# Altium schematic sheet SPILoRav5.SchDoc
size A
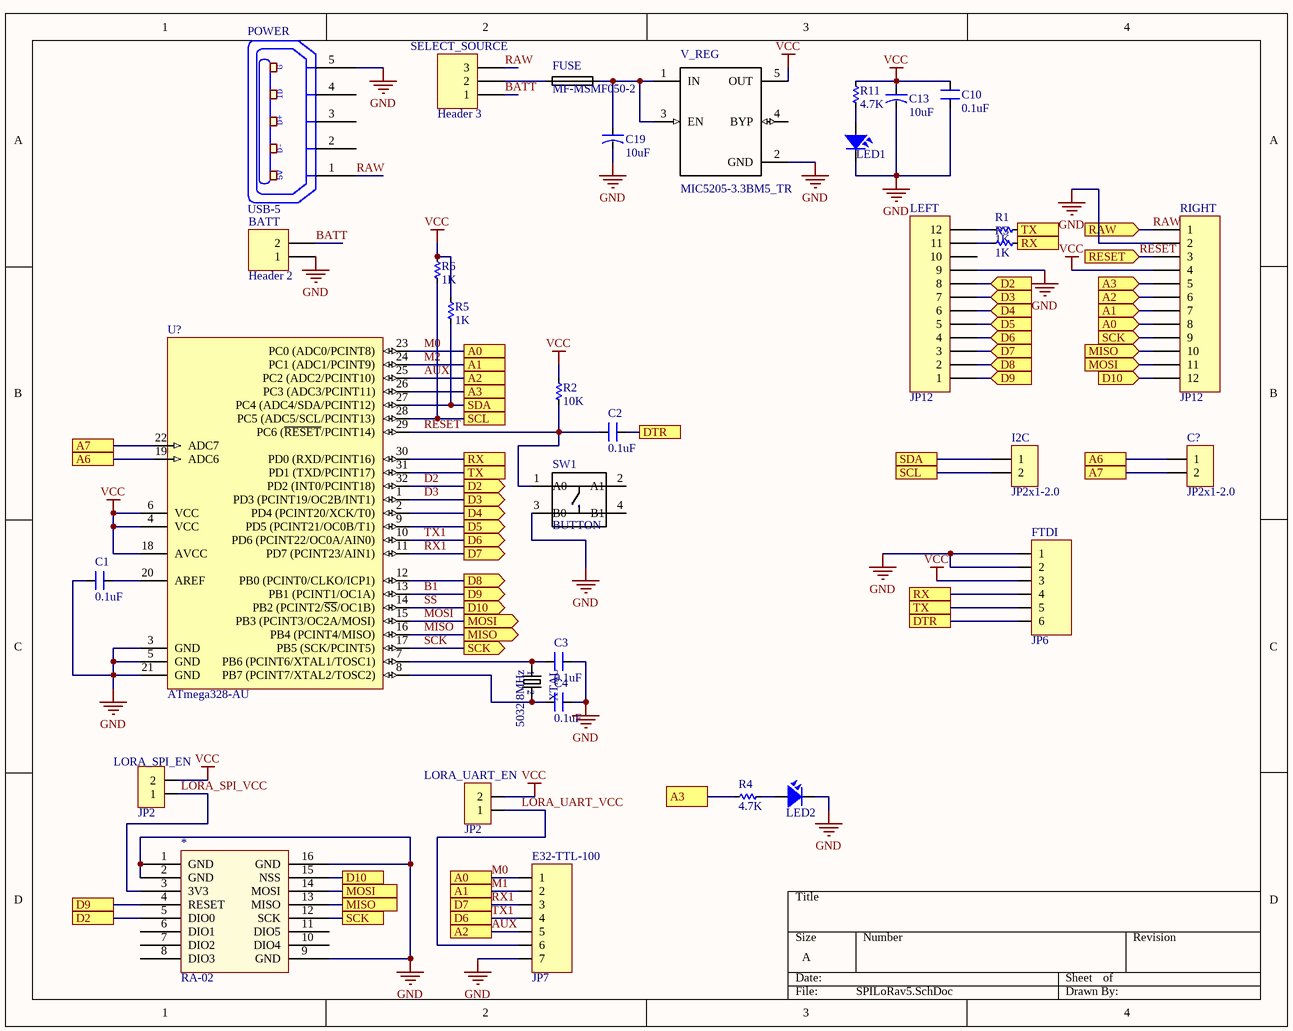
[diagram p0: SPILoRav5.SchDoc]

## Parts
*  RA-02  [RA-02]
BATT  Header 2  [HDR1X2]
C1  0.1uF  [CN-SMD-0805]
C2  0.1uF  [CN-SMD-0805]
C3  0.1uF  [CN-SMD-0805]
C4  0.1uF  [CN-SMD-0805]
C10  0.1uF  [CN-SMD-0805]
C13  10uF  [CAP-ALU-SMD-4.5x5x1.4]
C19  10uF  [CAP-ALU-SMD-4.5x5x1.4]
C?  JP2x1-2.0  [J2-C1T]
E32-TTL-100  JP7  [JP7-D1T]
FTDI  JP6  [JP6-C1T]
FUSE  MF-MSMF050-2  [*FUSM1812X02]
I2C  JP2x1-2.0  [J2-C1T]
LED1  LED  [LED-0805-Red]  (value not drawn)
LED2  LED  [LED-0805-Red]  (value not drawn)
LEFT  JP12  [JP12-D1T]
LORA_SPI_EN  JP2  [JP2-D1T]
LORA_UART_EN  JP2  [JP2-D1T]
POWER  USB-5  [USB-M1]
R1  1K  [RES-SMD-0805]
R2  10K  [RES-SMD-0805]
R3  1K  [RES-SMD-0805]
R4  4.7K  [RES-SMD-0805]
R5  1K  [RES-SMD-0805]
R6  1K  [RES-SMD-0805]
R11  4.7K  [RES-SMD-0805]
RIGHT  JP12  [JP12-D1T]
SELECT_SOURCE  Header 3  [HDR1X3]
SW1  BUTTON  [*SW4-SMD-5.2X5.2X1.5MM]
U?  ATmega328-AU  [TQFP32]
V_REG  MIC5205-3.3BM5_TR  [*SOT95P280X145-5N]
XTAL  5032 8MHz  [*X2-SMD-5.0X3.2X1.3MM]

## Ports
A0, A0 (in), A1, A1 (in), A2, A2 (in), A3, A3 (in), A6, A7, D2, D2 (in), D2 (out), D3 (in), D3 (out), D4 (in), D4 (out), D5 (in), D5 (out), D6, D6 (in), D6 (out), D7, D7 (in), D7 (out), D8 (in), D8 (out), D9, D9 (in), D9 (out), D10, D10 (in), D10 (out), DTR, MISO, MISO (in), MISO (out), MOSI, MOSI (in), MOSI (out), RAW (in), RESET (in), RX, RX (in), SCK, SCK (in), SCK (out), SCL, SDA, TX, TX (in)

## Nets
GND: *.1(GND) *.2(GND) *.9(GND) *.16(GND) BATT.1 C1.2 C3.1 C4.1 C10.1 C13.2 C19.2 E32-TTL-100.7 FTDI.1 FTDI.2 LED1.2 LED2.2 LEFT.9 POWER.5(P5) RIGHT.2 SW1.3(B0) U?.3(GND) U?.5(GND) U?.21(GND) V_REG.2(GND)
VCC: C10.2 C13.1 FTDI.3 LORA_SPI_EN.2 LORA_UART_EN.2 R2.1 R5.1 R6.1 R11.1 RIGHT.4 U?.4(VCC) U?.6(VCC) U?.18(AVCC) V_REG.5(OUT)
A3: R4.1 RIGHT.5 U?.26(PC3_(ADC3/PCINT11)) ; port A3
A6: C?.1 U?.19(ADC6) ; port A6
A7: C?.2 U?.22(ADC7) ; port A7
AUX: E32-TTL-100.5 RIGHT.6 U?.25(PC2_(ADC2/PCINT10)) ; port A2
B1: *.4(RESET) LEFT.1 U?.13(PB1_(PCINT1/OC1A)) ; port D9
BATT: BATT.2 SELECT_SOURCE.1
D2: *.5(DIO0) LEFT.8 U?.32(PD2_(INT0/PCINT18)) ; port D2
D3: LEFT.7 U?.1(PD3_(PCINT19/OC2B/INT1)) ; port D3
D4: LEFT.6 U?.2(PD4_(PCINT20/XCK/T0)) ; port D4
D5: LEFT.5 U?.9(PD5_(PCINT21/OC0B/T1)) ; port D5
D8: LEFT.2 U?.12(PB0_(PCINT0/CLKO/ICP1)) ; port D8
DTR: C2.2 FTDI.6 ; port DTR
LORA_SPI_VCC: *.3(3V3) LORA_SPI_EN.1
LORA_UART_VCC: E32-TTL-100.6 LORA_UART_EN.1
M0: E32-TTL-100.1 RIGHT.8 U?.23(PC0_(ADC0/PCINT8)) ; port A0
M1: E32-TTL-100.2 RIGHT.7 U?.24(PC1_(ADC1/PCINT9)) ; port A1  [also labelled M2]
MISO: *.13(MISO) RIGHT.10 U?.16(PB4_(PCINT4/MISO)) ; port MISO
MOSI: *.14(MOSI) RIGHT.11 U?.15(PB3_(PCINT3/OC2A/MOSI)) ; port MOSI
RAW: POWER.1(P1) RIGHT.1 SELECT_SOURCE.3 ; port RAW
RESET: C2.1 R2.2 RIGHT.3 SW1.1(A0) U?.29(PC6_(~{RESET}/PCINT14)) ; port RESET
RX: FTDI.4 R3.2 U?.30(PD0_(RXD/PCINT16)) ; port RX
RX1: E32-TTL-100.3 LEFT.3 U?.11(PD7_(PCINT23/AIN1)) ; port D7
SCK: *.12(SCK) RIGHT.9 U?.17(PB5_(SCK/PCINT5)) ; port SCK
SCL: I2C.2 R6.2 U?.28(PC5_(ADC5/SCL/PCINT13)) ; port SCL
SDA: I2C.1 R5.2 U?.27(PC4_(ADC4/SDA/PCINT12)) ; port SDA
SS: *.15(NSS) RIGHT.12 U?.14(PB2_(PCINT2/~{SS}/OC1B)) ; port D10
TX: FTDI.5 R1.2 U?.31(PD1_(TXD/PCINT17)) ; port TX
TX1: E32-TTL-100.4 LEFT.4 U?.10(PD6_(PCINT22/OC0A/AIN0)) ; port D6
NetC1_1: C1.1 U?.20(AREF)
NetC3_2: C3.2 U?.7(PB6_(PCINT6/XTAL1/TOSC1)) XTAL.1
NetC4_2: C4.2 U?.8(PB7_(PCINT7/XTAL2/TOSC2)) XTAL.2
NetC19_1: C19.1 FUSE.2 V_REG.1(IN) V_REG.3(EN)
NetFUSE_1: FUSE.1 SELECT_SOURCE.2
NetLED1_1: LED1.1 R11.2
NetLED2_1: LED2.1 R4.2
NetLEFT_11: LEFT.11 R3.1
NetLEFT_12: LEFT.12 R1.1

Not connected (* = marked no-connect by the designer): * 6(DIO1) 7(DIO2) 8(DIO3) 10(DIO4) 11(DIO5); LEFT 10; POWER 2(P2) 3(P3) 4(P4); SW1 2(A1) 4(B1); V_REG 4(BYP)

## Notes on the sheet
- (in symbol USB-5) G; ID; D+; D-; 5V

## Library data of the parts
BATT = Header 2: Header, 2-Pin; LatestRevisionDate: 17-Jul-2002; LatestRevisionNote: Re-released for DXP Platform.; Publisher: Altium Limited
C1-C4 C10 = CN: Value: 33pF
C13 C19 = CN-ALU-SMD: Polarized Capacitor (Axial); Published: 8-Jun-2000; LatestRevisionDate: 17-Jul-2002; LatestRevisionNote: Re-released for DXP Platform.; PackageReference: POLAR0.8; Publisher: Altium Limited
C? I2C = JP2x1-2.0: WR-PHD 2.00 mm Socket Header; Manufacturer: W¨¹rth Elektronik eiSos GmbH; partNo: 62000211821; ComponentLink1 Description: Manufacturer; ComponentLink2 Description: Datasheet; NoPins: 02; Created Date: 2 April 2013; ComponentLink1URL: http://www.we-online.com; ComponentLink2URL: http://katalog.we-online.de/em/datasheet/6200xx11821.pdf; Created by: Karrer Zheng
E32-TTL-100 = JP7: WR-PHD 2.54 mm Angled Socket Header; Manufacturer: W¨¹rth Elektronik eiSos GmbH; partNo: 613007143121; ComponentLink1 Description: Manufacturer; ComponentLink2 Description: Datasheet; NoPins: 07; Created Date: 29 March 2013; ComponentLink1URL: http://www.we-online.com; ComponentLink2URL: http://katalog.we-online.de/em/datasheet/6130xx143121.pdf; Created by: Karrer Zheng
FTDI = JP6: WR-PHD 2.54 mm Angled Socket Header; Manufacturer: W¨¹rth Elektronik eiSos GmbH; partNo: 613006143121; ComponentLink1 Description: Manufacturer; ComponentLink2 Description: Datasheet; NoPins: 06; Created Date: 29 March 2013; ComponentLink1URL: http://www.we-online.com; ComponentLink2URL: http://katalog.we-online.de/em/datasheet/6130xx143121.pdf; Created by: Karrer Zheng
FUSE = MF-MSMF050-2: PTC Resettable Fuse 0.5A_hold_ 1A_trip_ 15V 100A 0.8W 0.15s 0.15Ohm SMD Solder Pad 1812 T/R; MF: Bourns; MP: MF-MSMF050-2; Package: 1812 Bourns; Price: None; Availability: Unavailable; SnapEDA_Link: https://www.snapeda.com/parts/MF-MSMF050-2/Bourns%20-%20J.W.%20Miller/view-part/?ref=snap; Value: *
LED1 LED2 = LED SMD: Value: LED 3 - 5 ly 2 Colour
LEFT RIGHT = JP12: WR-PHD 2.54 mm Angled Socket Header; Manufacturer: W¨¹rth Elektronik eiSos GmbH; partNo: 613012143121; ComponentLink1 Description: Manufacturer; ComponentLink2 Description: Datasheet; NoPins: 12; Created Date: 29 March 2013; ComponentLink1URL: http://www.we-online.com; ComponentLink2URL: http://katalog.we-online.de/em/datasheet/6130xx143121.pdf; Created by: Karrer Zheng
LORA_SPI_EN LORA_UART_EN = JP2: WR-PHD 2.54 mm Angled Socket Header; Manufacturer: W¨¹rth Elektronik eiSos GmbH; partNo: 613002143121; ComponentLink1 Description: Manufacturer; ComponentLink2 Description: Datasheet; NoPins: 02; Created Date: 29 March 2013; ComponentLink1URL: http://www.we-online.com; ComponentLink2URL: http://katalog.we-online.de/em/datasheet/6130xx143121.pdf; Created by: Karrer Zheng
POWER = USB-5: Manufacturer: FCI; Manufacturer Part Number: 10118193-0001LF; Connector Type: USB - micro B; Number of Contacts: 5; Gender: Receptacle; Specifications: USB 2.0; .Creator: MM; .Checked PCB: RF; Supplier 1: Digi-Key; RoHS: RoHS Compliant; Category: Connectors, Interconnects; Stock 1: 28642; Pricing 1: 1=0.46, 10=0.433, 25=0.3712, 50=0.3156, 100=0.3032, 250=0.27224, 500=0.25988 (USD); Packaging: Cut Tape (CT); Mounting Type: Surface Mount, Right Angle, Horizontal; Features: Shielded, Solder Retention; Ingress Protection: -; ComponentLink1URL: http://portal.fciconnect.com/Comergent//fci/drawing/10118193.pdf; ComponentLink1Description: http://portal.fciconnect.com/Comergent//fci/drawing/10118193.pdf; Supplier Part Number 1: 609-4616-1-ND; .Checked SCH: MM
R1-R6 R11 = Res-SMD: Resistor; Manufacturer: Generic Components; Class: Passive; Published: 08/06/2000; Publisher: Altium Hobart Technology Centre
SELECT_SOURCE = Header 3: Header, 3-Pin; LatestRevisionDate: 17-Jul-2002; LatestRevisionNote: Re-released for DXP Platform.; Publisher: Altium Limited
SW1 = SMD-BUTTON(4P-5.2X5.2X1.5MM-SKQGAKE010): Switch Tactile N.O. SPST Button Gull Wing 0.05A 12VDC 3.43N SMD T/R; MF: ALPS; Availability: Unavailable; Package: None; Price: None; SnapEDA_Link: https://www.snapeda.com/parts/SKQGAKE010/ALPS/view-part/?ref=snap; MP: SKQGAKE010; Value: *
U? = ATmega328-AU: 8-bit AVR Microcontroller, 32KB Flash, 1KB EEPROM, 2KB SRAM, 32-pin TQFP, Industrial Grade (-40°C to 85°C); Published: 1-Apr-2010; DatasheetVersion: revA, Jan-2010; PackageVersion: revB, Oct-2001; PackageReference: 32A; Publisher: Altium Limited; PackageDescription: 32-Lead, 7x7x1.0 mm Body, 0.8mm Lead Pitch, Thin Profile Plastic Quad Flat Package (TQFP); Supplier 1: Digi-Key; Supplier Part Number 1: ATMEGA328-AU-ND; Supplier 2: Mouser; Supplier Part Number 2: 556-ATMEGA328-AU; Code_JEDEC: MS-026-ABA; ComponentLink1Description: Manufacturer Link; ComponentLink1URL: http://www.atmel.com/products/avr/default.asp?; ComponentLink2Description: ATmega48A/48PA/88A/88PA/168A/168PA/328/328P Datasheet; ComponentLink2URL: http://www.atmel.com/dyn/resources/prod_documents/8271.pdf; ComponentLink3Description: ATmega48A/48PA/88A/88PA/168A/168PA/328/328P Summary; ComponentLink3URL: http://www.atmel.com/dyn/resources/prod_documents/8271S.pdf; ComponentLink4Description: Atmel.com Home; ComponentLink4URL: http://www.atmel.com
V_REG = MIC5205-3.3BM5_TR: Ic Reg Ldo 3.3v 0.15a Sot23-5; MF: Micrel; MP: MIC5205-3.3BM5 TR; Availability: Unavailable; Package: SOT-23-5 Micrel; Price: None; SnapEDA_Link: https://www.snapeda.com/parts/MIC5205-3.3BM5%20TR/Micrel/view-part/?ref=snap; Value: *
XTAL = SMD-CRYSTAL-8MHZ-20PF-20PPM(2P-5.0X3.2MM): SMD Crystal 8MHz-20pF-20ppm;; MP: 5032/4P; MF: Xinhunjing; Package: None; Price: None; Availability: Unavailable; SnapEDA_Link: https://www.snapeda.com/parts/5032/4P/Xinhunjing/view-part/?ref=snap; Value: *